# Altium schematic sheet Power_Supply2.SchDoc
size A
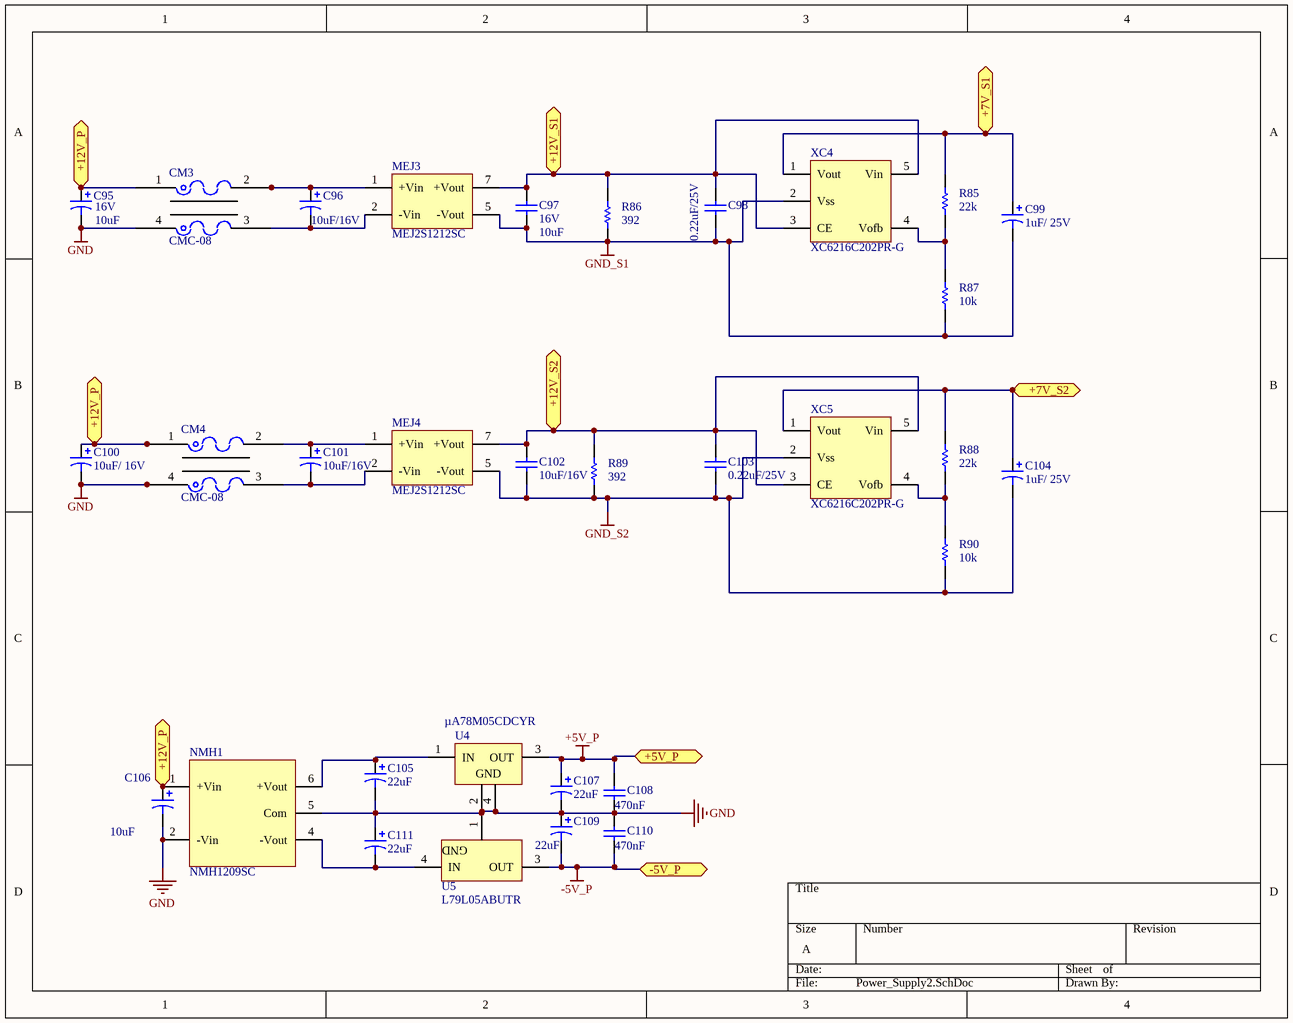
[diagram p0: Power_Supply2.SchDoc]

## Parts
C95  16V  value 10uF  [1812]
C96  value 10uF/16V  [1812]  (hidden comment: Cap Pol3)
C97  16V  value 10uF  [C1206]
C98  value 0.22uF/25V  [C1206]  (hidden comment: Cap Semi)
C99  value 1uF/ 25V  [C0805]  (hidden comment: Cap Pol3)
C100  value 10uF/ 16V  [1812]  (hidden comment: Cap Pol3)
C101  value 10uF/16V  [1812]  (hidden comment: Cap Pol3)
C102  value 10uF/16V  [C1206]  (hidden comment: Cap Semi)
C103  value 0.22uF/25V  [C1206]  (hidden comment: Cap Semi)
C104  value 1uF/ 25V  [C0805]  (hidden comment: Cap Pol3)
C105  value 22uF  [Cap tantal 22u-25V]  (hidden comment: Tantalium)
C106  value 10uF  [CAP-10u-16V]  (hidden comment: electrolytic)
C107  value 22uF  [Cap Tantal 3216]  (hidden comment: Tantalium/T520A226M006ATE090)
C108  value 470nF  [Capacitor 0805]  (hidden comment: Cap)
C109  value 22uF  [Cap Tantal 3216]  (hidden comment: Tantalium/T520A226M006ATE090)
C110  value 470nF  [Capacitor 0805]  (hidden comment: Cap)
C111  value 22uF  [Cap tantal 22u-25V]  (hidden comment: Tantalium)
CM3  CMC-08  [CMC-08]
CM4  CMC-08  [CMC-08]
MEJ3  MEJ2S1212SC  [MEJ2]
MEJ4  MEJ2S1212SC  [MEJ2]
NMH1  NMH1209SC  [NMH1209SC]
R85  res_smd  [res_smd]  (value not drawn)
R86  res_smd  [res_smd]  (value not drawn)
R87  res_smd  [res_smd]  (value not drawn)
R88  res_smd  [res_smd]  (value not drawn)
R89  res_smd  [res_smd]  (value not drawn)
R90  res_smd  [res_smd]  (value not drawn)
U4  µA78M05CDCYR  [Reg - SOT223]
U5  L79L05ABUTR  [Reg SOT-89]
XC4  XC6216C202PR-G  [SOT-89-5]
XC5  XC6216C202PR-G  [SOT-89-5]

## Ports
+5V_P (bidir), +7V_S1 (bidir), +7V_S2 (bidir), +12V_P (bidir), +12V_S1 (bidir), +12V_S2 (bidir), -5V_P (bidir)

## Nets
+5V_P: C107.1 C108.2 U4.3(OUT) ; port +5V_P
-5V_P: C109.2 C110.1 U5.3(OUT) ; port -5V_P
GND: C95.2 C100.2 C105.2 C106.2 C107.2 C108.1 C109.1 C110.2 C111.1 CM3.4 CM4.4 NMH1.2(-Vin) NMH1.5(Com) U4.2(GND) U4.4(GND) U5.1(GND)
GND_S1: C97.1 C98.1 C99.2 MEJ3.5(-Vout) R86.2 R87.2 XC4.2(Vss)
GND_S2: C102.1 C103.1 C104.2 MEJ4.5(-Vout) R89.2 R90.2 XC5.2(Vss)
+7V_S1: C99.1 R85.1 XC4.1(Vout) ; port +7V_S1
+7V_S2: C104.1 R88.1 XC5.1(Vout) ; port +7V_S2
+12V_P: C95.1 C100.1 C106.1 CM3.1 CM4.1 NMH1.1(+Vin) ; port +12V_P
+12V_S1: C97.2 C98.2 MEJ3.7(+Vout) R86.1 XC4.3(CE) XC4.5(Vin) ; port +12V_S1
+12V_S2: C102.2 C103.2 MEJ4.7(+Vout) R89.1 XC5.3(CE) XC5.5(Vin) ; port +12V_S2
NetC96_1: C96.1 CM3.2 MEJ3.1(+Vin)
NetC96_2: C96.2 CM3.3 MEJ3.2(-Vin)
NetC101_1: C101.1 CM4.2 MEJ4.1(+Vin)
NetC101_2: C101.2 CM4.3 MEJ4.2(-Vin)
NetC105_1: C105.1 NMH1.6(+Vout) U4.1(IN)
NetC111_2: C111.2 NMH1.4(-Vout) U5.4(IN)
NetR85_2: R85.2 R87.1 XC4.4(Vofb)
NetR88_2: R88.2 R90.1 XC5.4(Vofb)

## Notes on the sheet
- (in symbol res_smd) 392; 22k; 10k

## Library data of the parts
C95 C96 C99-C101 C104 = Cap Pol3: Polarized Capacitor (Surface Mount); Published: 8-Jun-2000; LatestRevisionDate: 29-May-2009; LatestRevisionNote: IPC-7351 Footprint Added.; PackageReference: C0805; Publisher: Altium Limited; PackageDescription: Chip Capacitor
C97 C98 C102 C103 = Cap Semi: Capacitor (Semiconductor SIM Model); Published: 8-Jun-2000; LatestRevisionDate: 29-May-2009; LatestRevisionNote: IPC-7351 Footprint Added.; PackageReference: C1206; Publisher: Altium Limited; PackageDescription: Chip Capacitor
C105-C107 C109 C111 = Cap Pol1: Polarized Capacitor (Radial); Published: 8-Jun-2000; LatestRevisionDate: 17-Jul-2002; LatestRevisionNote: Re-released for DXP Platform.; PackageReference: RB7.6-15; Publisher: Altium Limited
C108 C110 = Cap: Capacitor; Published: 8-Jun-2000; LatestRevisionDate: 17-Jul-2002; LatestRevisionNote: Re-released for DXP Platform.; PackageReference: RAD-0.3; Publisher: Altium Limited
CM3 CM4 = CMC-08: Common mode choke
MEJ3 MEJ4 = Power supply2
NMH1 = NMH----SC_1
R85-R90 = res_smd: smd_res
U4 = µA7805CKTER: Positive-Voltage Regulator; Note: Pin 2 is electrically connected to TAB/Pin4.; Published: 15-Apr-2002; DatasheetVersion: Jul-1999; PackageVersion: Jan-2001; PackageReference: KTE03; Publisher: Altium Limited; PackageDescription: PowerFLEX; 3 Leads; Body 10.7 (inc. leads) x 9.5 mm (LxW max); Code_JEDEC: MO-169; ComponentLink1Description: Manufacturer Link; ComponentLink1URL: http://www.ti.com/; ComponentLink2Description: Datasheet; ComponentLink2URL: http://www-s.ti.com/sc/ds/ua7805.pdf
U5 = µA79M05CKTPR: Negative-Voltage Regulator; Note: Pin 2 is electrically connected to pin4, and not drawn.; Published: 15-Apr-2002; DatasheetVersion: Apr-2000; PackageVersion: Jan-2001; PackageReference: KTP02; Publisher: Altium Limited; PackageDescription: PowerFLEX (D-PAK/TO-252-AA); 3 Leads (1 Cropped); Body 9.7 (inc. leads) x 6.2 mm (LxW max); Code_JEDEC: TO-252; ComponentLink1Description: Manufacturer Link; ComponentLink1URL: http://www.ti.com/; ComponentLink2Description: Datasheet; ComponentLink2URL: http://www-s.ti.com/sc/ds/ua79m05.pdf
XC4 XC5 = power supply